# EAGLE design rc2014-graphics-card (EAGLE 7.7.0)
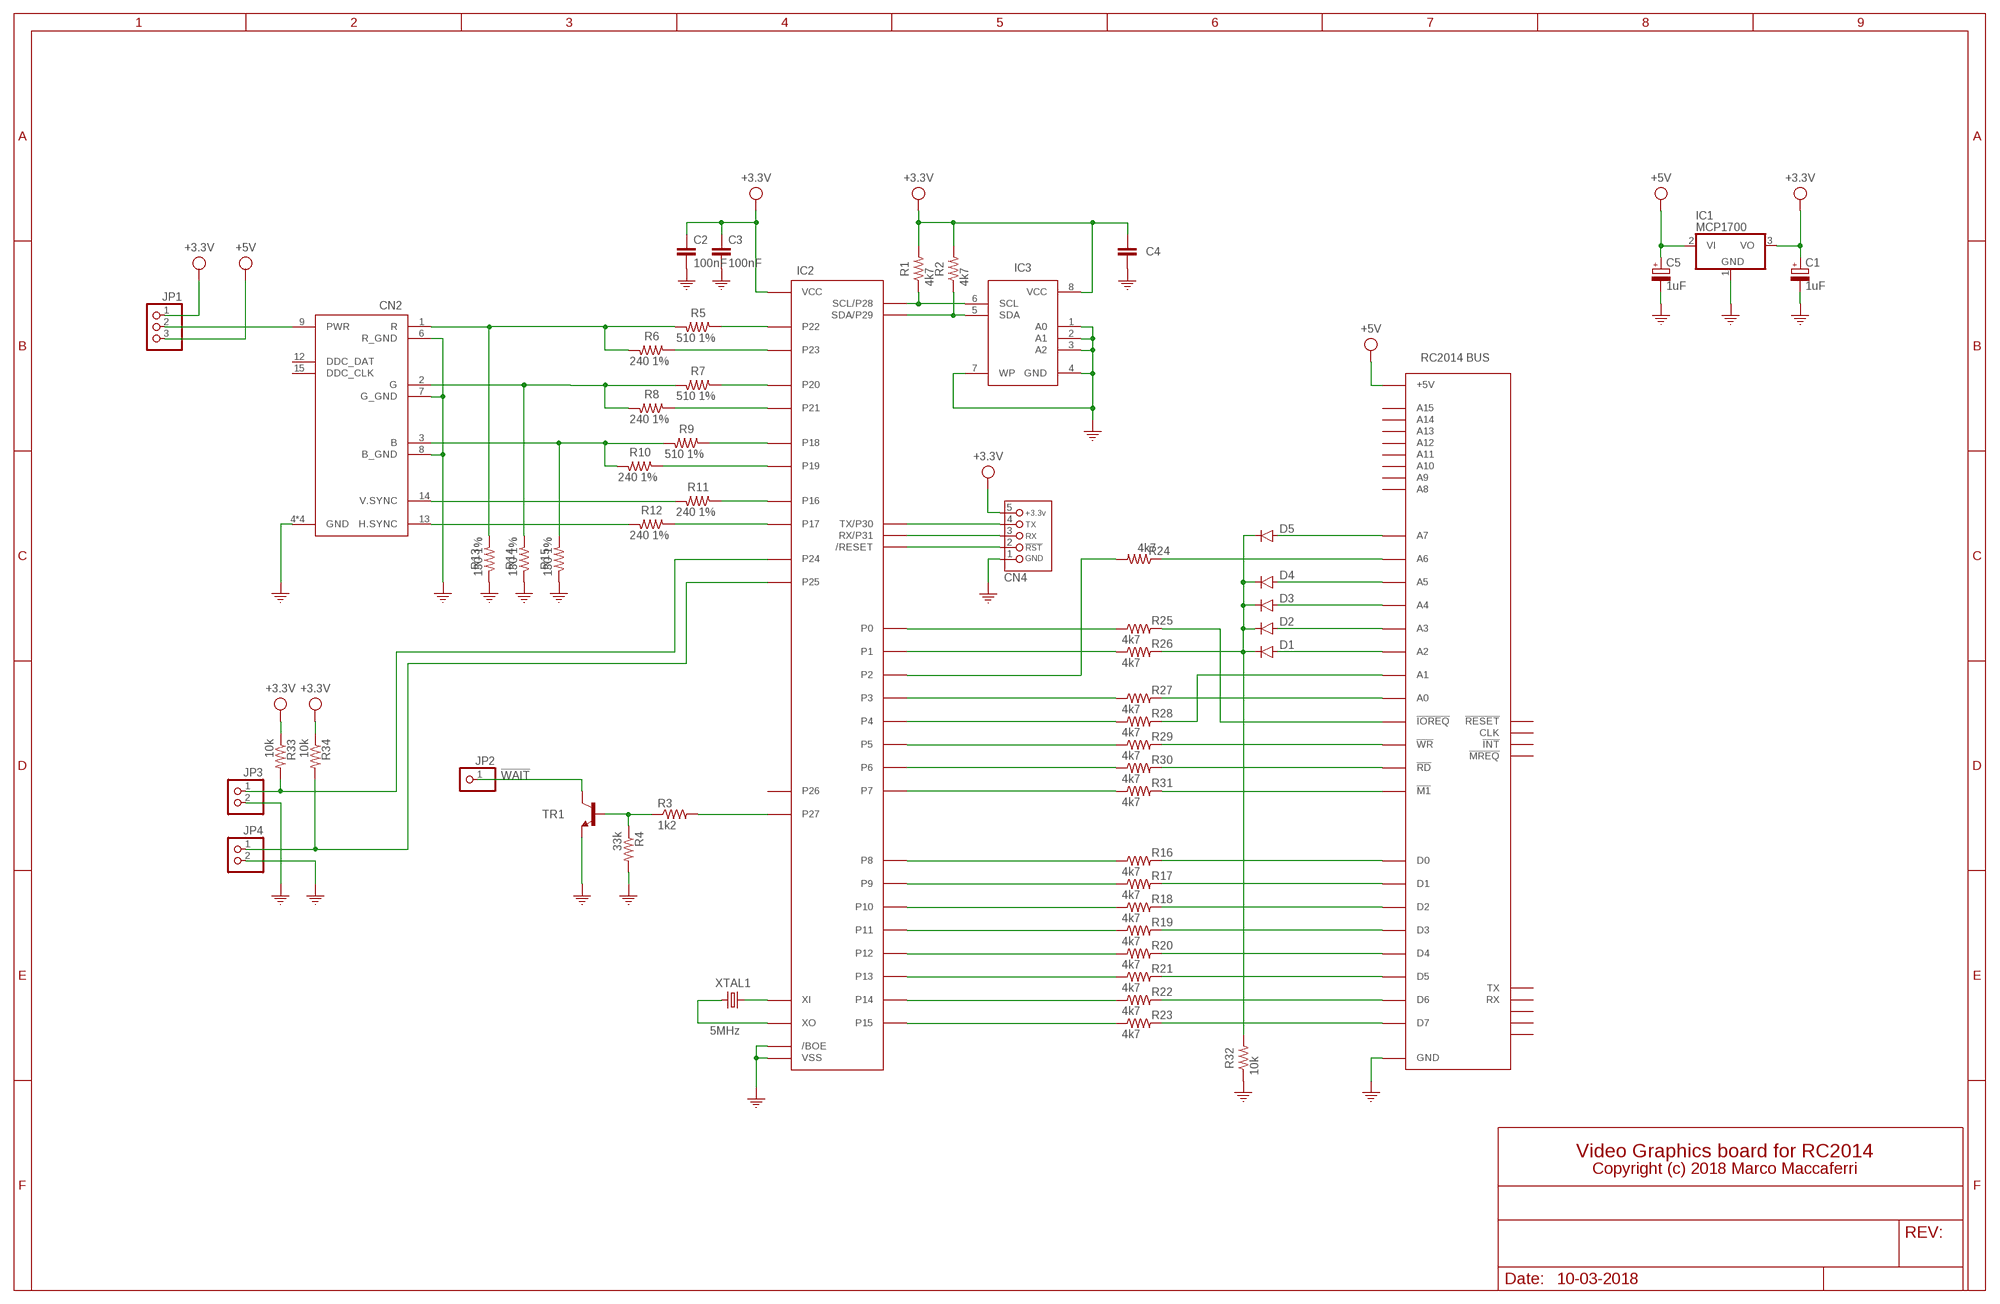
[diagram p0: schematic, sheet 1]

## Parts
C1  1uF  CP-2.5-6  [E2,5-6]
C2  100nF  C  [C050-025X075]
C3  100nF  C  [C050-025X075]
C4  100nF  C  [C050-025X075]
C5  1uF  CP-2.5-6  [E2,5-6]
CN1  RC2014BUS  [RC2014BUS]
CN2  VGA  [VGA]
CN4  PROPELLER_ICSP_HEADER  [HEADER_PRG_1X05]
D1  1N4148DO35-7  [DO35-7]
D2  1N4148DO35-7  [DO35-7]
D3  1N4148DO35-7  [DO35-7]
D4  1N4148DO35-7  [DO35-7]
D5  1N4148DO35-7  [DO35-7]
IC1  MCP1700  [TO92]
IC2  P8X32A-B-D40  [DIL40]
IC3  24LC512-I/P  [DIL08]
JP1  PINHD-1X3  [1X03]
JP2  PINHD-1X1  [1X01]
JP3  PINHD-1X2  [1X02]
JP4  PINHD-1X2  [1X02]
R1  4k7  R-1/4W  [0207/10]
R2  4k7  R-1/4W  [0207/10]
R3  1k2  R-1/4W  [0207/10]
R4  33k  R-1/8W  [0204/7]
R5  510 1%  R-1/4W  [0207/10]
R6  240 1%  R-1/4W  [0207/10]
R7  510 1%  R-1/4W  [0207/10]
R8  240 1%  R-1/4W  [0207/10]
R9  510 1%  R-1/4W  [0207/10]
R10  240 1%  R-1/4W  [0207/10]
R11  240 1%  R-1/4W  [0207/10]
R12  240 1%  R-1/4W  [0207/10]
R13  130 1%  R-1/4W  [0207/10]
R14  130 1%  R-1/4W  [0207/10]
R15  130 1%  R-1/4W  [0207/10]
R16  4k7  R-1/8W  [0204/7]
R17  4k7  R-1/8W  [0204/7]
R18  4k7  R-1/8W  [0204/7]
R19  4k7  R-1/8W  [0204/7]
R20  4k7  R-1/8W  [0204/7]
R21  4k7  R-1/8W  [0204/7]
R22  4k7  R-1/8W  [0204/7]
R23  4k7  R-1/8W  [0204/7]
R24  4k7  R-1/8W  [0204/7]
R25  4k7  R-1/8W  [0204/7]
R26  4k7  R-1/8W  [0204/7]
R27  4k7  R-1/8W  [0204/7]
R28  4k7  R-1/8W  [0204/7]
R29  4k7  R-1/8W  [0204/7]
R30  4k7  R-1/8W  [0204/7]
R31  4k7  R-1/8W  [0204/7]
R32  10k  R-1/8W  [0204/7]
R33  10k  R-1/4W  [0207/10]
R34  10k  R-1/4W  [0207/10]
TR1  BC547A  [TO92]
XTAL1  5MHz  CRYSTAL-HC49/S  [HC49/S]

## Nets
!IOREQ!: IC2.1(P0) R25.1
!M1!: IC2.8(P7) R31.1
!RD!: IC2.7(P6) R30.1
!WAIT!: JP2.1 TR1.1(C)
!WR!: IC2.6(P5) R29.1
+3.3V: C1.+ C2.1 C3.1 C4.1 CN4.5 IC1.3(VO) IC2.12(VCC) IC2.32(VCC) IC3.8(VCC) JP1.1 R1.2 R2.2 R33.1 R34.1
+5V: C5.+ CN1.+5V IC1.2(VI) JP1.3
A0: IC2.4(P3) R27.1
A1: IC2.5(P4) R28.1
A6: IC2.3(P2) R24.2
ADDR: IC2.2(P1) R26.1
B: CN2.3(B) R9.2 R10.2 R15.2
D0: IC2.13(P8) R16.1
D1: IC2.14(P9) R17.1
D2: IC2.15(P10) R18.1
D3: IC2.16(P11) R19.1
D4: IC2.17(P12) R20.1
D5: IC2.18(P13) R21.1
D6: IC2.19(P14) R22.1
D7: IC2.20(P15) R23.1
G: CN2.2(G) R7.2 R8.2 R14.2
GND: C1.- C2.2 C3.2 C4.2 C5.- CN1.GND CN2.4(GND) CN2.5(GND) CN2.6(R_GND) CN2.7(G_GND) CN2.8(B_GND) CN2.10(GND) CN2.11(GND) CN4.1 IC1.1(GND) IC2.9(VSS) IC2.10(/BOE) IC2.29(VSS) IC3.1(A0) IC3.2(A1) IC3.3(A2) IC3.4(GND) IC3.7(WP) JP3.2 JP4.2 R4.2 R13.1 R14.1 R15.1 R32.1 TR1.3(E)
GPU_SCL: IC2.37(SCL/P28) IC3.6(SCL) R1.1
GPU_SDA: IC2.38(SDA/P29) IC3.5(SDA) R2.1
HSYNC: CN2.13(H.SYNC) R12.2
N$1: IC2.30(XI) XTAL1.1
N$2: IC2.31(XO) XTAL1.2
N$3: CN1.D3 R19.2
N$4: CN1.D2 R18.2
N$5: CN1.D1 R17.2
N$6: CN1.D0 R16.2
N$7: CN1.D4 R20.2
N$8: CN1.D5 R21.2
N$9: CN1.D6 R22.2
N$10: CN1.D7 R23.2
N$11: CN4.2 IC2.11(/RESET)
N$12: CN4.3 IC2.40(RX/P31)
N$14: CN4.4 IC2.39(TX/P30)
N$22: CN1.A3 D2.A
N$23: CN1.A4 D3.A
N$24: CN1.A5 D4.A
N$25: CN1.A6 R24.1
N$26: CN1.A7 D5.A
N$27: D1.C D2.C D3.C D4.C D5.C R26.2 R32.2
N$28: CN1.A2 D1.A
N$29: CN1.A1 R28.2
N$30: CN1.A0 R27.2
N$31: CN1.!RD! R30.2
N$32: CN1.!WR! R29.2
N$33: CN1.!M1! R31.2
N$35: CN1.!IOREQ! R25.2
N$43: CN2.9(PWR) JP1.2
N$44: R3.1 R4.1 TR1.2(B)
N$45: IC2.36(P27) R3.2
N$46: IC2.33(P24) JP3.1 R33.2
N$47: IC2.34(P25) JP4.1 R34.2
P16: IC2.21(P16) R11.1
P17: IC2.22(P17) R12.1
P18: IC2.23(P18) R9.1
P19: IC2.24(P19) R10.1
P20: IC2.25(P20) R7.1
P21: IC2.26(P21) R8.1
P22: IC2.27(P22) R5.1
P23: IC2.28(P23) R6.1
R: CN2.1(R) R5.2 R6.2 R13.2
VSYNC: CN2.14(V.SYNC) R11.2
Unconnected: CN1.!INT! CN1.!MREQ! CN1.!RESET! CN1.A8 CN1.A9 CN1.A10 CN1.A11 CN1.A12 CN1.A13 CN1.A14 CN1.A15 CN1.CLK CN1.RX CN1.SPARE1 CN1.SPARE2 CN1.SPARE3 CN1.TX CN2.12(DDC_DAT) CN2.15(DDC_CLK) IC2.35(P26)

## Notes on the sheet
- RC2014 BUS
- Video Graphics board for RC2014
- Copyright (c) 2018 Marco Maccaferri
- 10-03-2018

## Library data of the parts
C1 C5 = rc2014-graphics-card:CP: Polarized Capacitor; MPN: ESK105M050AC3AA
C2-C4 = rc2014-graphics-card:C: Capacitor; MPN: R82EC3100AA70J
CN1 = rc2014-graphics-card:RC2014BUS; MPN: PRPC040SBAN-M71RC
CN2 = rc2014-graphics-card:VGA: SUB-D; MPN: 1734344-1; OC_FARNELL: unknown; OC_NEWARK: unknown
CN4 = rc2014-vga:PROPELLER_ICSP_HEADER; MPN: PRPC005SAAN-RC
D1-D5 = rc2014-graphics-card:1N4148: DIODE high speed (Philips)
IC1 = rc2014-vga:MCP1700; MPN: MCP1700-3302E/TO
IC2 = rc2014-graphics-card:P8X32A-B: Parallax Propeller; MPN: P8X32A-D40
IC3 = rc2014-vga:24LC*; MPN: 24LC256-I/P
JP1 = rc2014-graphics-card:PINHD-1X3: PIN HEADER
JP2 = rc2014-graphics-card:PINHD-1X1: PIN HEADER
JP3 JP4 = rc2014-graphics-card:PINHD-1X2: PIN HEADER
R1 R2 = rc2014-graphics-card:R: Resistor; MPN: CFR-25JB-52-4K7
R3 R4 R16-R34 = rc2014-graphics-card:R: Resistor
R5 R7 R9 = rc2014-graphics-card:R: Resistor; MPN: RNMF14FTC510R
R6 R8 R10-R12 = rc2014-graphics-card:R: Resistor; MPN: RNMF14FTC240R
R13-R15 = rc2014-graphics-card:R: Resistor; MPN: RNMF14FTC130R
TR1 = p8x-2016-propplug:BC547*: NPN Transistor
XTAL1 = rc2014-vga:CRYSTAL; MPN: ECS-50-20-4X

## Board
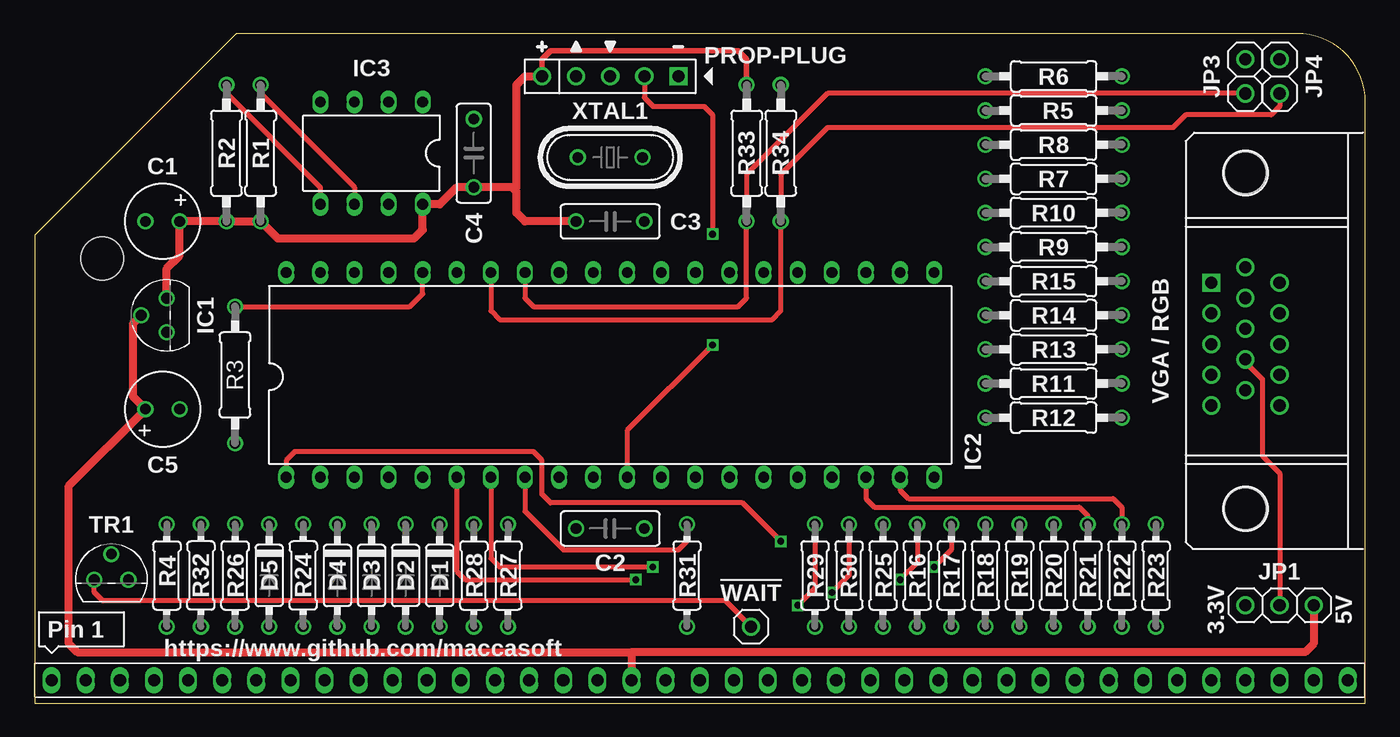
[diagram p1: board, top side]
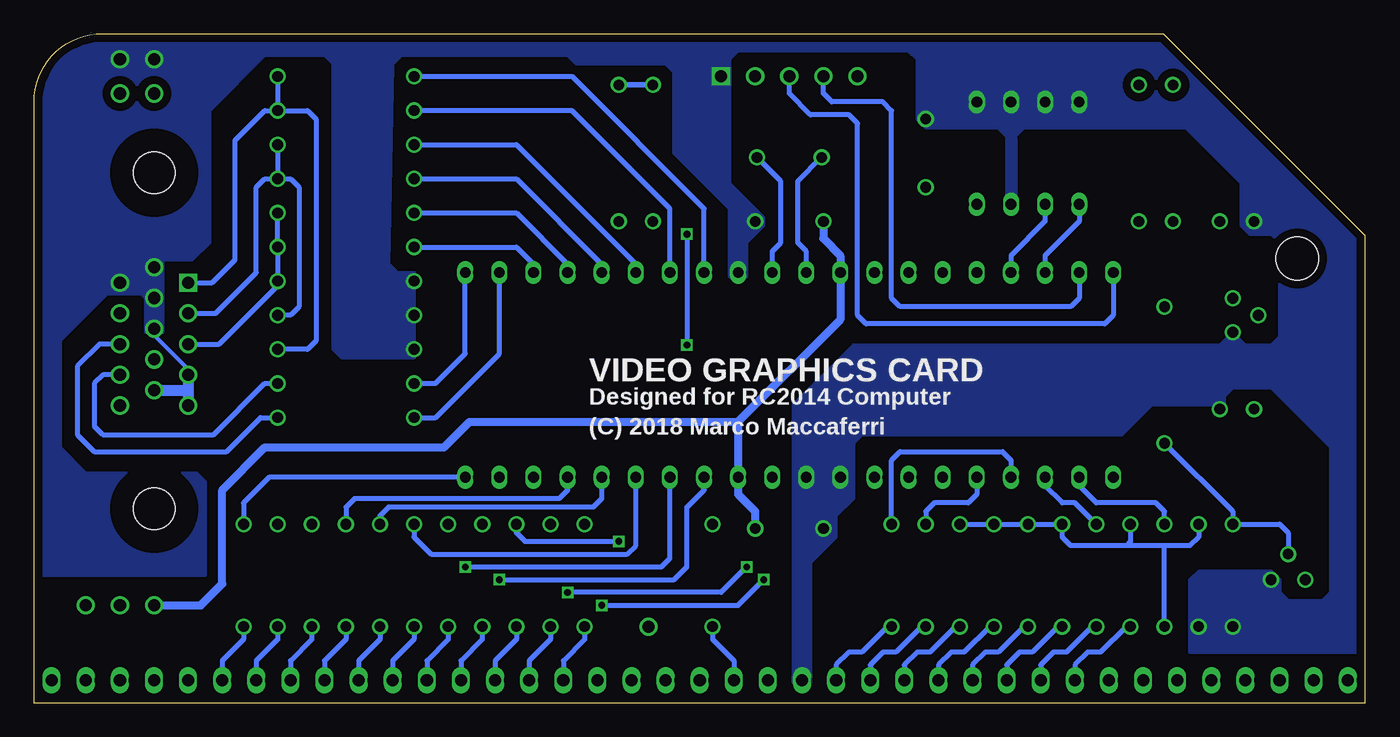
[diagram p2: board, bottom side, seen from below]

Size 99.11 x 49.86 mm. Coordinates in mm from the lower left corner, seen from the top.
Outline: 0,0 99.11,0 99.11,44.76 arc90 94.01,49.86 15.01,49.86 0,34.85 0,0
Copper layers (1*16): Top 0.0356mm / dielectric 1.5011mm / Bottom 0.0356mm
Design rules "aisler *": minimum track width 6mil, minimum drill 0.4mm, track to track 6mil, track to pad 6mil, pad to pad 6mil, via to via 6mil, smd to smd 6mil, copper to edge 15mil, drill to drill 6mil, minimum pad ring 7mil, minimum via ring 7mil, stop-mask expansion 2.5mil, vias tented up to drill 30mil, thermal gap 10mil
Holes 3.2 mm at 5.03,33.12

### Footprints (pad centres in the part's own frame; a part is rotated, then mirrored left to right if it is on the bottom)
E2,5-6 = drill 0.8: + -1.27,0; - 1.27,0
C050-025X075 = drill 0.8: 1 -2.54,0; 2 2.54,0
RC2014BUS = drill 0.9 long: !INT! 0,-5.08; !IOREQ! 0,-15.24; !M1! 0,2.54; !MREQ! 0,-7.62; !RD! 0,-12.7; !RESET! 0,0; !WR! 0,-10.16; +5V 0,5.08; A0 0,10.16; A1 0,12.7; A2 0,15.24; A3 0,17.78; A4 0,20.32; A5 0,22.86; A6 0,25.4; A7 0,27.94; A8 0,30.48; A9 0,33.02; A10 0,35.56; A11 0,38.1; A12 0,40.64; A13 0,43.18; A14 0,45.72; A15 0,48.26; CLK 0,-2.54; D0 0,-17.78; D1 0,-20.32; D2 0,-22.86; D3 0,-25.4; D4 0,-27.94; D5 0,-30.48; D6 0,-33.02; D7 0,-35.56; GND 0,7.62; RX 0,-40.64; SPARE1 0,-43.18; SPARE2 0,-45.72; SPARE3 0,-48.26; TX 0,-38.1
VGA = drill 0.9 square: 1 4.329,2.54 | drill 0.9: 2 2.043,2.54; 3 -0.243,2.54; 4 -2.529,2.54; 5 -4.815,2.54; 6 5.472,0; 7 3.186,0; 8 0.9,0; 9 -1.386,0; 10 -3.672,0; 11 4.329,-2.54; 12 2.043,-2.54; 13 -0.243,-2.54; 14 -2.529,-2.54; 15 -4.815,-2.54 | hole 3.1: -12.5,0; 12.5,0
HEADER_PRG_1X05 = drill 0.9 square: 1 -5.08,0 | drill 0.9: 2 -2.54,0; 3 0,0; 4 2.54,0; 5 5.08,0
DO35-7 = drill 0.8: A 3.81,0; C -3.81,0
TO92 = drill 0.8: 1 -1.27,0; 2 0,1.905; 3 1.27,0
DIL40 = drill 0.8 long: 1 -24.13,-7.62; 2 -21.59,-7.62; 3 -19.05,-7.62; 4 -16.51,-7.62; 5 -13.97,-7.62; 6 -11.43,-7.62; 7 -8.89,-7.62; 8 -6.35,-7.62; 9 -3.81,-7.62; 10 -1.27,-7.62; 11 1.27,-7.62; 12 3.81,-7.62; 13 6.35,-7.62; 14 8.89,-7.62; 15 11.43,-7.62; 16 13.97,-7.62; 17 16.51,-7.62; 18 19.05,-7.62; 19 21.59,-7.62; 20 24.13,-7.62; 21 24.13,7.62; 22 21.59,7.62; 23 19.05,7.62; 24 16.51,7.62; 25 13.97,7.62; 26 11.43,7.62; 27 8.89,7.62; 28 6.35,7.62; 29 3.81,7.62; 30 1.27,7.62; 31 -1.27,7.62; 32 -3.81,7.62; 33 -6.35,7.62; 34 -8.89,7.62; 35 -11.43,7.62; 36 -13.97,7.62; 37 -16.51,7.62; 38 -19.05,7.62; 39 -21.59,7.62; 40 -24.13,7.62
DIL08 = drill 0.8 long: 1 -3.81,-3.81; 2 -1.27,-3.81; 3 1.27,-3.81; 4 3.81,-3.81; 5 3.81,3.81; 6 1.27,3.81; 7 -1.27,3.81; 8 -3.81,3.81
1X03 = drill 0.9: 1 -2.54,0; 2 0,0; 3 2.54,0
1X01 = drill 0.9: 1 0,0
1X02 = drill 0.9: 1 -1.27,0; 2 1.27,0
0207/10 = drill 0.8: 1 -5.08,0; 2 5.08,0
0204/7 = drill 0.8: 1 -3.81,0; 2 3.81,0
HC49/S = drill 0.8: 1 -2.413,0; 2 2.413,0

### Placement (x,y rotation side)
C1  9.53,35.88 180 top
C2  42.86,13.02 180 top
C3  42.86,35.88 0 top
C4  32.7,40.96 90 top
C5  9.53,21.91 0 top
CN1  49.53,1.72 90 top
CN2  90.17,26.99 90 top
CN4  42.86,46.67 180 top
D1  30.16,9.53 270 top
D2  27.62,9.53 270 top
D3  25.08,9.53 270 top
D4  22.54,9.53 270 top
D5  17.46,9.53 270 top
IC1  9.84,28.89 90 top
IC2  42.86,24.45 0 top
IC3  25.08,40.96 180 top
JP1  92.71,7.3 0 top
JP2  53.34,5.71 0 top
JP3  90.17,46.67 90 top
JP4  92.71,46.67 90 top
R1  16.83,40.96 270 top
R2  14.29,40.96 270 top
R3  14.92,24.45 90 top
R4  9.84,9.53 270 top
R5  75.88,44.13 0 top
R6  75.88,46.67 0 top
R7  75.88,39.05 0 top
R8  75.88,41.59 0 top
R9  75.88,33.97 0 top
R10  75.88,36.51 0 top
R11  75.88,23.81 0 top
R12  75.88,21.27 0 top
R13  75.88,26.35 0 top
R14  75.88,28.89 0 top
R15  75.88,31.43 0 top
R16  65.72,9.53 270 top
R17  68.26,9.53 270 top
R18  70.8,9.53 270 top
R19  73.34,9.53 270 top
R20  75.88,9.53 270 top
R21  78.42,9.53 270 top
R22  80.96,9.53 270 top
R23  83.5,9.53 270 top
R24  20,9.53 90 top
R25  63.18,9.53 270 top
R26  14.92,9.53 270 top
R27  35.24,9.53 270 top
R28  32.7,9.53 270 top
R29  58.1,9.53 270 top
R30  60.64,9.53 270 top
R31  48.58,9.53 270 top
R32  12.38,9.53 90 top
R33  53.02,40.96 270 top
R34  55.56,40.96 270 top
TR1  5.71,9.21 0 top
XTAL1  42.86,40.64 180 top

### Tracks (layer width: path | path; a pad name or v marks a point on that pad's centre or on a via)
!IOREQ!  (via drill 0.5)
  Top 0.356: v55.56,12.06 52.7,14.92 38.42,14.92 37.78,15.56 37.78,18.1 37.15,18.73 19.37,18.73 18.73,18.1 IC2.1
  Bottom 0.356: R25.1 63.18,12.7 62.55,12.06 v55.56,12.06
!M1!
  Top 0.356: IC2.8 36.51,14.29 39.37,11.43 47.94,11.43 48.58,12.06 R31.1
!RD!  (via drill 0.5)
  Top 0.356: R30.1 60.64,9.53 v59.37,8.26 | IC2.7 33.97,10.79 34.61,10.16 v46.04,10.16
  Bottom 0.356: v46.04,10.16 47.94,8.26 v59.37,8.26
!WAIT!
  Top 0.356: JP2.1 51.44,7.62 5.08,7.62 4.45,8.26 TR1.1
!WR!  (via drill 0.5)
  Top 0.356: R29.1 58.1,8.57 v56.83,7.3 | IC2.6 31.43,9.84 32.07,9.21 v44.77,9.21
  Bottom 0.356: v44.77,9.21 46.67,7.3 v56.83,7.3
+3.3V
  Top 0.406: CN4.5 37.78,47.94 38.42,48.58 52.39,48.58 53.02,47.94 R33.1
  Top 0.61: 35.56,38.42 35.88,38.42 35.88,46.04 36.51,46.67 CN4.5 | 35.56,38.42 C4.1 31.43,38.42 30.16,37.15 IC3.8 28.89,35.24 28.26,34.61 18.1,34.61 R1.2 R2.2 C1.+ 10.79,33.34 9.84,32.38 IC1.3 | C3.1 36.51,35.88 35.88,36.51 35.88,38.1 35.56,38.42
  Bottom 0.406: R33.1 R34.1
  Bottom 0.61: C2.1 45.4,14.29 46.67,15.56 IC2.12 46.67,20.95 | 46.67,20.95 39.05,28.57 IC2.32 39.05,33.34 40.32,34.61 C3.1 | JP1.1 86.68,7.3 85.09,8.89 85.09,15.88 81.92,19.05 68.58,19.05 66.67,20.95 46.67,20.95
+5V
  Top 0.61: IC1.2 7.3,28.26 7.3,22.86 C5.+ 2.54,16.19 2.54,4.45 3.17,3.81 44.45,3.81 | 44.45,3.81 CN1.+5V | JP1.3 95.25,4.45 94.61,3.81 44.45,3.81
A0
  Bottom 0.356: R27.1 35.24,18.1 34.61,18.73 26.99,18.73 26.35,18.1 IC2.4
A1
  Bottom 0.356: IC2.5 28.89,15.56 29.53,14.92 32.07,14.92 32.7,14.29 R28.1
A6
  Bottom 0.356: R24.2 21.59,14.92 22.54,14.92 23.81,16.19 IC2.3
ADDR
  Bottom 0.356: R26.1 14.92,14.29 15.56,14.92 20,14.92 21.27,16.19 IC2.2
B
  Bottom 0.356: R10.2 R9.2 R15.2 80.64,31.43 85.33,26.74 CN2.3
D0  (via drill 0.5)
  Top 0.356: R16.1 65.72,10.48 v64.45,9.21
  Bottom 0.356: v64.45,9.21 51.44,9.21 50.48,10.16 50.48,14.61 49.21,15.88 IC2.13
D1  (via drill 0.5)
  Top 0.356: R17.1 68.26,11.43 v66.99,10.16
  Bottom 0.356: v66.99,10.16 52.39,10.16 51.75,10.79 IC2.14
D2
  Bottom 0.356: R18.1 70.8,12.38 69.53,11.11 54.93,11.11 54.29,11.75 IC2.15
D3
  Bottom 0.356: IC2.16 56.83,15.24 57.47,14.61 72.71,14.61 73.34,13.97 R19.1
D4
  Bottom 0.356: IC2.17 59.37,15.88 60.01,15.24 75.25,15.24 75.88,14.61 R20.1
D5
  Top 0.356: IC2.18 61.91,15.24 62.55,14.61 77.79,14.61 78.42,13.97 R21.1
D6
  Top 0.356: IC2.19 64.45,15.88 65.09,15.24 80.33,15.24 80.96,14.61 R22.1
D7
  Bottom 0.356: IC2.20 81.6,16.83 83.5,14.92 R23.1
G
  Bottom 0.356: R8.2 R7.2 | R7.2 80.01,39.05 79.38,38.42 79.38,29.53 80.01,28.89 R14.2 | CN2.2 85.59,29.03 82.55,32.07 82.55,38.42 81.92,39.05 R7.2
GND
  Bottom 0.305: CN2.8 90.17,27.42 87.63,24.88 CN2.4
  Bottom 0.813: CN2.4 87.63,23.18 | 87.63,23.18 CN2.5 | CN2.10 87.77,23.32 87.63,23.18
  pour Bottom (isolate 0.61, no thermals): 41.27,1.59 42.55,1.59 42.55,22.23 38.1,26.67 10.79,26.67 10.16,27.3 9.53,27.3 8.89,26.67 6.99,26.67 6.35,27.3 6.35,34.29 6.99,34.92 8.57,34.92 9.21,35.56 9.21,38.73 13.34,42.86 25.4,42.86 26.04,42.23 26.04,36.83 26.67,36.83 26.67,42.23 27.3,42.86 32.7,42.86 33.34,43.5 33.34,47.94 33.97,48.58 46.67,48.58 47.31,47.94 47.31,38.73 44.77,36.2 44.77,35.56 46.04,34.29 46.04,31.75 47.31,31.75 47.31,36.83 51.44,40.96 51.44,46.99 52.07,47.62 58.74,47.62 59.37,48.26 71.75,48.26 72.39,47.62 72.71,32.7 72.07,32.07 70.8,32.07 70.8,25.72 76.2,25.72 76.83,26.35 76.83,47.62 77.47,48.26 81.92,48.26 86.04,44.13 86.04,34.29 87.31,33.02 89.53,33.02 89.53,27.62 90.81,27.62 90.81,30.16 91.12,30.48 93.66,30.48 97.16,26.99 97.16,19.05 95.25,17.14 87,17.14 86.36,16.51 86.36,9.53 99.06,9.53 99.06,49.85 14.92,49.85 0,34.92 0,3.81 13.02,3.81 13.02,9.21 12.38,9.84 6.99,9.84 6.35,9.21 6.35,8.26 5.71,7.62 3.17,7.62 2.54,8.26 2.54,19.05 6.99,23.5 9.84,23.5 10.48,22.86 10.48,22.23 15.88,22.23 18.1,20 37.47,20 38.1,19.37 38.1,15.24 39.37,13.97 39.37,12.38 41.27,10.48
GPU_SCL
  Top 0.356: R1.1 16.83,45.4 23.81,38.42 IC3.6
  Bottom 0.356: IC3.6 23.81,35.88 26.35,33.34 IC2.37
GPU_SDA
  Top 0.356: R2.1 14.29,45.4 21.27,38.42 IC3.5
  Bottom 0.356: IC3.5 21.27,35.88 23.81,33.34 IC2.38
HSYNC
  Bottom 0.356: CN2.13 94.22,26.74 95.89,25.08 95.89,20 94.61,18.73 84.77,18.73 82.23,21.27 R12.2
N$1
  Bottom 0.356: IC2.30 44.13,33.66 43.5,34.29 43.5,38.86 XTAL1.1
N$2
  Bottom 0.356: IC2.31 41.59,33.66 42.23,34.29 42.23,38.86 XTAL1.2
N$3
  Bottom 0.356: R19.2 73.34,4.76 74.93,3.17 CN1.D3
N$4
  Bottom 0.356: R18.2 70.8,4.76 72.39,3.17 CN1.D2
N$5
  Bottom 0.356: R17.2 68.26,4.76 69.85,3.17 CN1.D1
N$6
  Bottom 0.356: R16.2 65.72,4.76 67.31,3.17 CN1.D0
N$7
  Bottom 0.356: R20.2 75.88,4.76 77.47,3.17 CN1.D4
N$8
  Bottom 0.356: R21.2 78.42,4.76 80.01,3.17 CN1.D5
N$9
  Bottom 0.356: R22.2 80.96,4.76 82.55,3.17 CN1.D6
N$10
  Bottom 0.356: R23.2 83.5,4.76 85.09,3.17 CN1.D7
N$11  (via drill 0.5)
  Top 0.356: CN4.2 45.4,45.09 46.04,44.45 49.85,44.45 50.48,43.81 v50.48,34.92 | v50.48,26.67 44.13,20.32 IC2.11
  Bottom 0.356: v50.48,34.92 v50.48,26.67
N$12
  Bottom 0.356: IC2.40 18.73,28.89 19.37,28.26 37.15,28.26 37.78,28.89 37.78,43.18 38.42,43.81 41.27,43.81 42.86,45.4 CN4.3
N$14
  Bottom 0.356: IC2.39 21.27,30.16 21.91,29.53 34.61,29.53 35.24,30.16 35.24,44.13 35.88,44.77 39.69,44.77 40.32,45.4 CN4.4
N$22
  Bottom 0.356: D2.A 27.94,5.71 29.84,3.81 30.8,3.81 31.75,2.86 CN1.A3
N$23
  Bottom 0.356: D3.A 25.4,5.71 27.3,3.81 28.26,3.81 29.21,2.86 CN1.A4
N$24
  Bottom 0.356: D4.A 22.86,5.71 24.77,3.81 25.72,3.81 26.67,2.86 CN1.A5
N$25
  Bottom 0.356: R24.1 20.32,5.71 22.23,3.81 23.18,3.81 24.13,2.86 CN1.A6
N$26
  Bottom 0.356: D5.A 17.78,5.71 19.68,3.81 20.64,3.81 21.59,2.86 CN1.A7
N$27
  Bottom 0.356: D1.C D2.C D3.C D4.C 22.54,12.38 21.91,11.75 17.78,11.75 | R32.2 12.38,12.38 13.02,11.75 14.92,11.75 | 14.92,11.75 17.78,11.75 | D5.C 17.46,12.06 17.78,11.75 | R26.2 14.92,11.75
N$28
  Bottom 0.356: D1.A 30.48,5.71 32.38,3.81 33.34,3.81 34.29,2.86 CN1.A2
N$29
  Bottom 0.356: R28.2 33.02,5.71 34.92,3.81 35.88,3.81 36.83,2.86 CN1.A1
N$30
  Bottom 0.356: R27.2 35.56,5.71 37.47,3.81 38.42,3.81 39.37,2.86 CN1.A0
N$31
  Bottom 0.356: R30.2 60.64,4.76 62.23,3.17 CN1.!RD!
N$32
  Bottom 0.356: R29.2 58.1,4.76 59.69,3.17 CN1.!WR!
N$33
  Bottom 0.356: R31.2 48.58,4.76 46.99,3.17 CN1.!M1!
N$35
  Bottom 0.356: R25.2 63.18,4.76 64.77,3.17 CN1.!IOREQ!
N$43
  Top 0.356: CN2.9 90.17,25.4 91.44,24.13 91.44,18.41 92.71,17.14 JP1.2
N$44
  Bottom 0.356: TR1.2 5.71,12.7 6.35,13.34 R4.1 9.84,14.29 R3.1
N$45
  Top 0.356: R3.2 27.94,29.53 28.89,30.48 IC2.36
N$46
  Top 0.356: IC2.33 36.51,30.16 37.15,29.53 52.39,29.53 53.02,30.16 R33.2 53.02,39.37 59.05,45.4 JP3.1
N$47
  Top 0.356: IC2.34 33.97,29.21 34.61,28.57 54.93,28.57 55.56,29.21 R34.2 55.56,39.37 59.05,42.86 84.77,42.86 85.72,43.81 92.08,43.81 92.71,44.45 JP4.1
P16
  Bottom 0.356: R11.1 69.22,23.81 66.99,26.04 IC2.21
P17
  Bottom 0.356: R12.1 69.22,21.27 64.45,26.04 IC2.22
P18
  Bottom 0.356: R9.1 63.18,33.97 61.91,32.7 IC2.23
P19
  Bottom 0.356: R10.1 63.18,36.51 59.37,32.7 IC2.24
P20
  Bottom 0.356: R7.1 63.18,39.05 56.83,32.7 IC2.25
P21
  Bottom 0.356: R8.1 63.18,41.59 54.29,32.7 IC2.26
P22
  Bottom 0.356: IC2.27 51.75,36.83 59.05,44.13 R5.1
P23
  Bottom 0.356: R6.1 59.05,46.67 49.21,36.83 IC2.28
R
  Bottom 0.356: R6.2 R5.2 | R5.2 78.74,44.13 78.11,43.5 78.11,26.99 78.74,26.35 R13.2 | CN2.1 85.84,31.32 84.14,33.02 84.14,41.91 81.92,44.13 R5.2
VSYNC
  Bottom 0.356: CN2.14 93.97,24.46 94.61,23.81 94.61,20.64 93.98,20 85.72,20 81.92,23.81 R11.2

### Text on the board
tNames: PROP-PLUG | VGA / RGB | !WAIT! | 3.3V | 5V | https://www.github.com/maccasoft
bNames: VIDEO GRAPHICS CARD | Designed for RC2014 Computer | (C) 2018 Marco Maccaferri